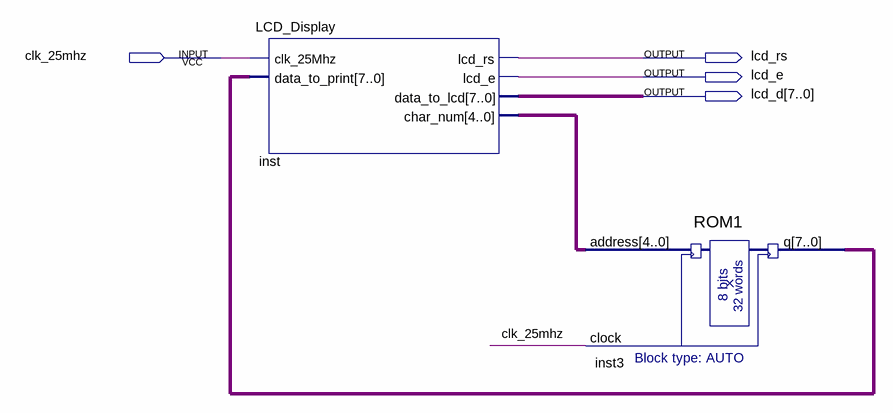
[diagram p0: schematic sheet]
// Quartus schematic LCD.bdf as structural Verilog: 2 symbols, 4 pins
module LCD (
  input  clk_25mhz,
  output lcd_rs,
  output lcd_e,
  output [7:0] lcd_d
);

  wire [4:0] inst_char_num;
  wire [7:0] inst3_q;

  LCD_Display inst (
    .clk_25Mhz(clk_25mhz), .data_to_print(inst3_q), .lcd_rs(lcd_rs), .lcd_e(lcd_e), .data_to_lcd(lcd_d),
    .char_num(inst_char_num));
  ROM1 inst3 (.address(inst_char_num), .clock(clk_25mhz), .q(inst3_q));
endmodule
